# Altium schematic sheet BMS_peripherial.SchDoc
size 420 x 297 mm; SheetNumber: 2; SheetTotal: 5
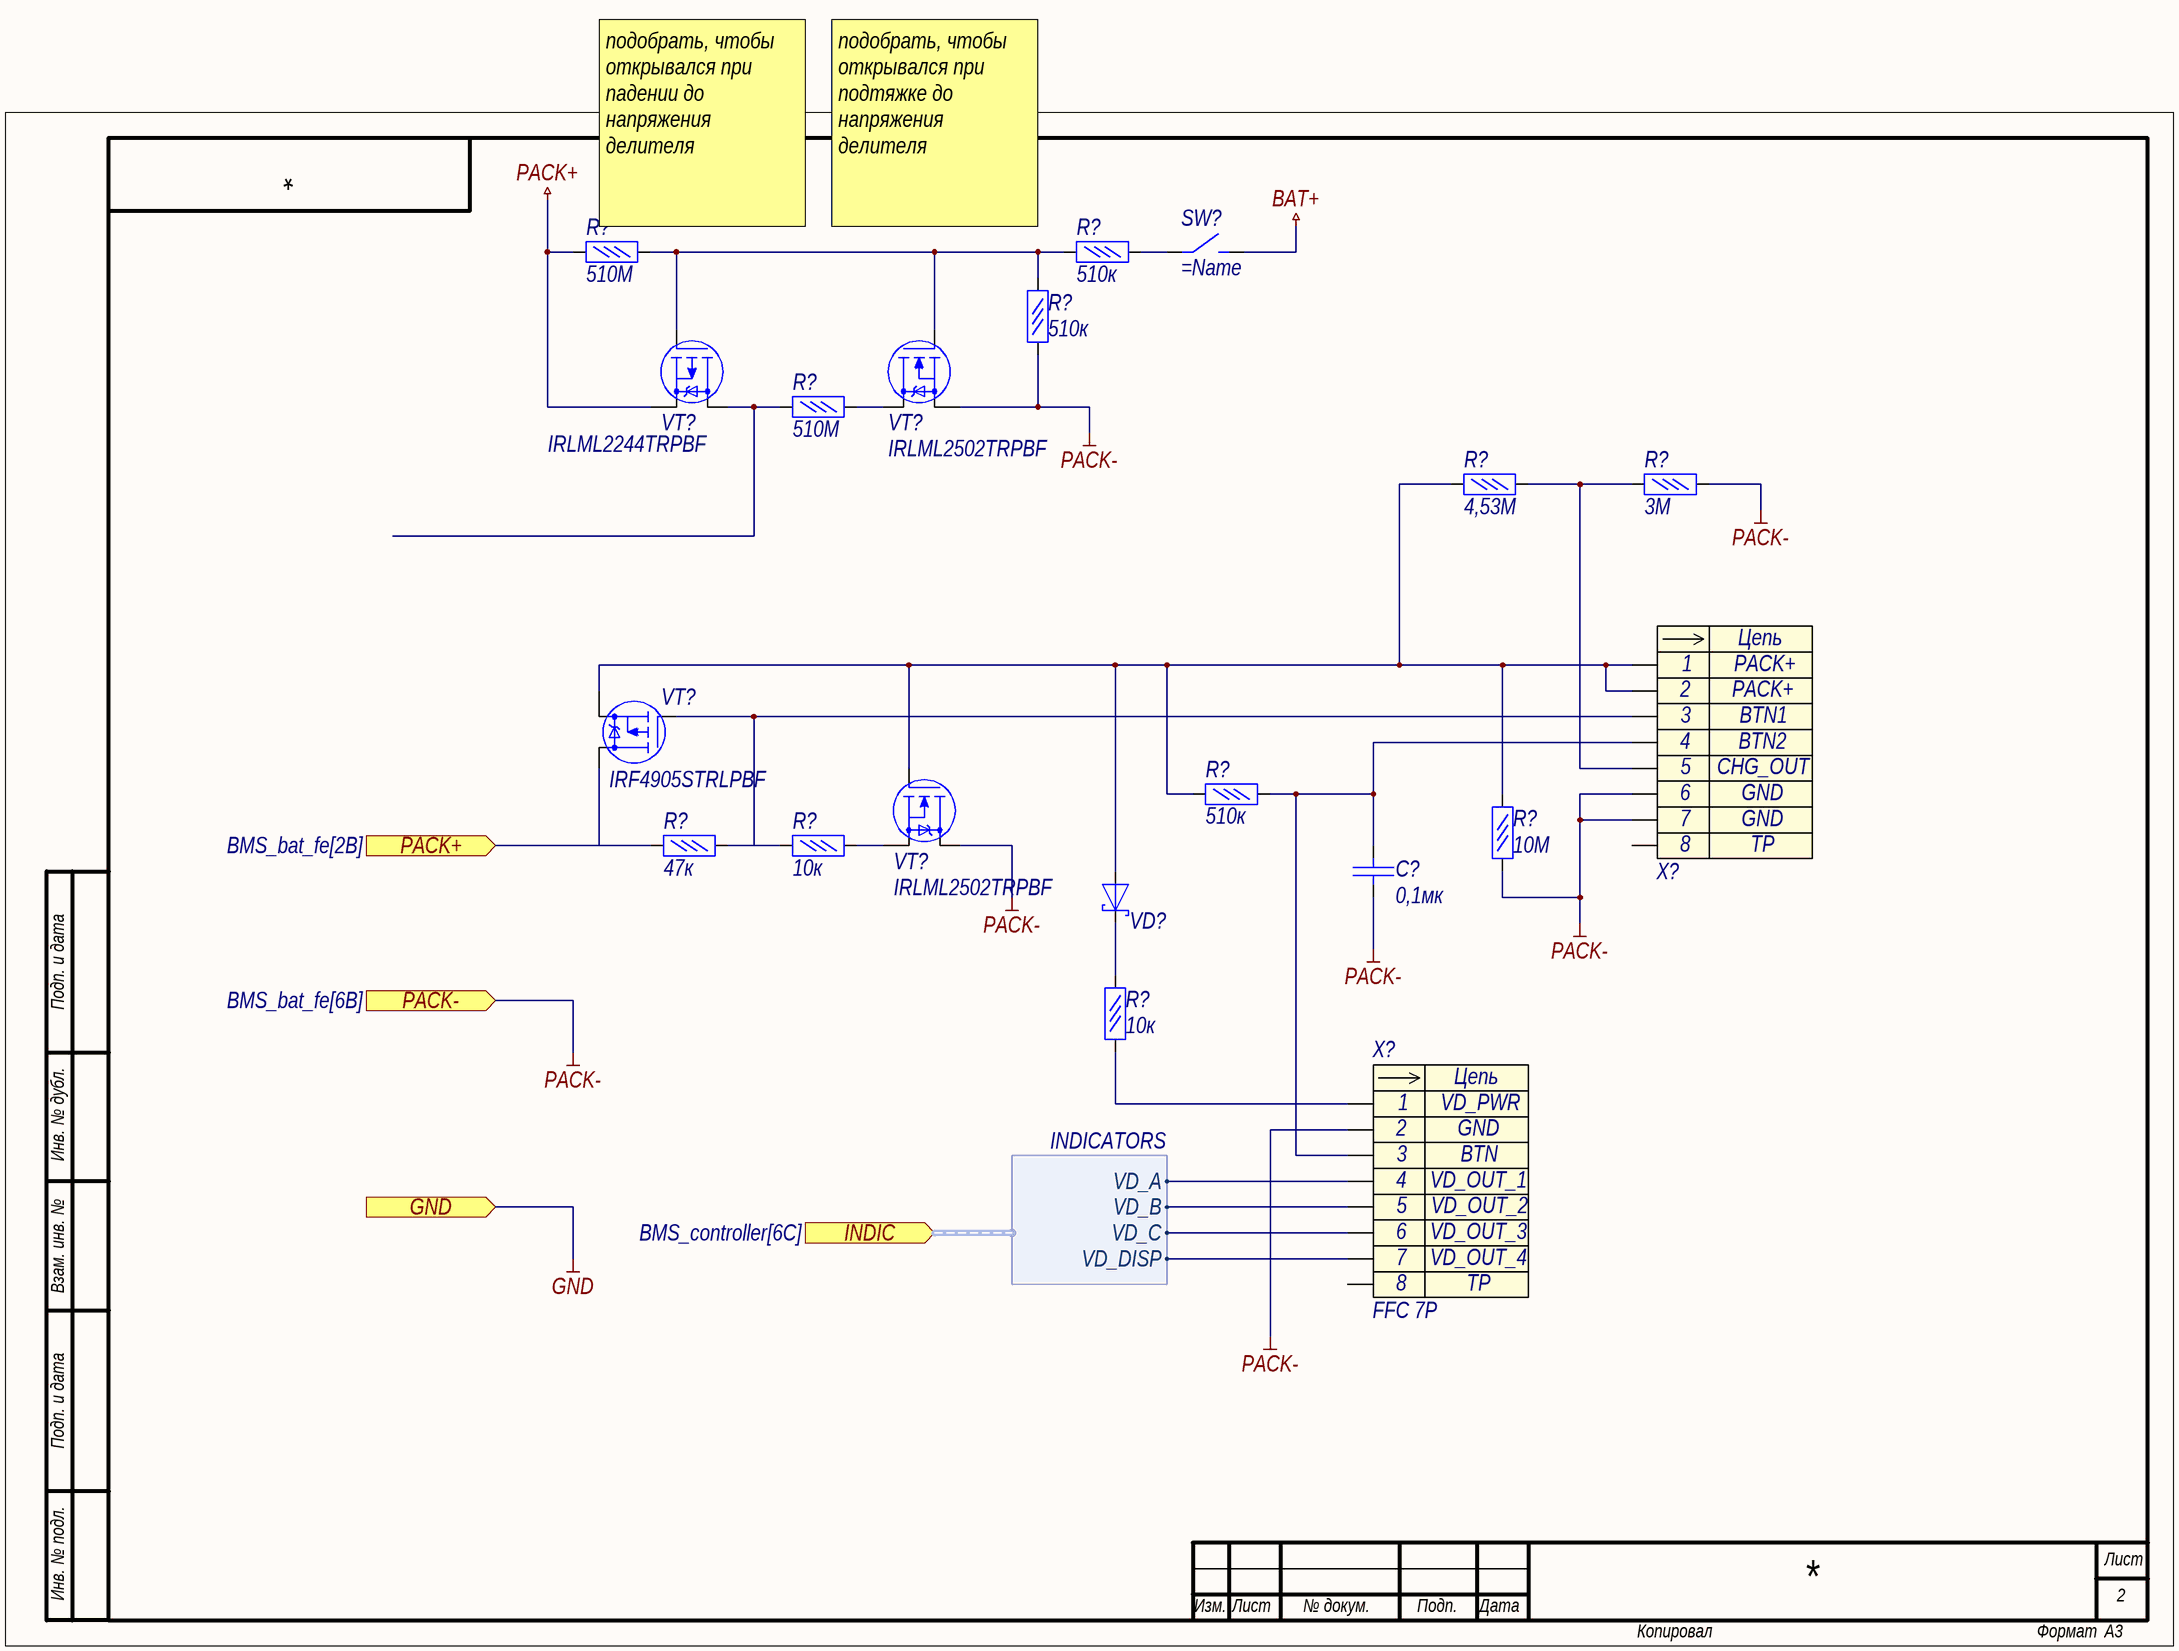
[diagram p0: BMS_peripherial.SchDoc]

## Parts
(Parts that share a designator on the sheet are numbered #1, #2 ... from top to bottom, then left to right.)
R?#1  510М  [R0603]
R?#2  510к  [R0603]
R?#3  510к  [R0603]
R?#4  510М  [R0603]
R?#5  4,53М  [R0603]
R?#6  3М  [R0603]
R?#7  10к  [R0603]
R?#8  510к  [R0603]
R?#9  47к  [R0603]
R?#10  10М  [R0603]
R?#11  10к  [R0603]
SW?  (no value)  [it-1187]
VD?  1N5817WS  [SOD323]  (value not drawn)
VT?#1  IRLML2244TRPBF  [SOT23]
VT?#2  IRLML2502TRPBF  [SOT23]
VT?#3  IRF4905STRLPBF  [D2PAK]
VT?#4  IRLML2502TRPBF  [SOT23]
X?#1  (no value)  [2+5P Header]
X?#2  FFC 7P  [LCP UL94-V0]
С?  0,1мк  [C0603]

## Ports
GND (in), INDIC (in, harness INDICATORS, see BMS_controller[6C]), PACK+ (in, see BMS_bat_fe[2B]), PACK- (in, see BMS_bat_fe[6B])

## Harnesses
INDICATORS: VD_A, VD_B, VD_C, VD_DISP

## Nets
BAT+: SW?.2
GND: port GND
PACK+: R?#1.2 VT?#1.2(S)
PACK-: R?#3.1 R?#6.1 R?#10.1 VT?#2.2(S) VT?#4.3(D) X?#1.6 X?#1.7 X?#2.2 С?.2 ; port PACK-
PACK+: R?#9.1 VT?#3.3(D) ; port PACK+  [a separate net that carries the same name]
NetR?#1_1: R?#1.1 R?#2.1 R?#3.2 VT?#1.1(G) VT?#2.1(G)
NetR?#2_2: R?#2.2 SW?.1
NetR?#4_1: R?#4.1 VT?#2.3(D)
NetR?#4_2: R?#4.2 VT?#1.3(D)
NetR?#5_1: R?#5.1 R?#6.2 X?#1.5
NetR?#5_2: R?#5.2 R?#8.1 R?#10.2 VD?.2(A) VT?#3.2(S) VT?#4.1(G) X?#1.1 X?#1.2
NetR?#7_1: R?#7.1 VT?#4.2(S)
NetR?#7_2: R?#7.2 R?#9.2 VT?#3.1(G) X?#1.3
NetR?#8_2: R?#8.2 X?#1.4 X?#2.3 С?.1
NetR?#11_1: R?#11.1 X?#2.1
NetR?#11_2: R?#11.2 VD?.1(K)
NetX?#2_4: X?#2.4 ; port INDIC.VD_A
NetX?#2_5: X?#2.5 ; port INDIC.VD_B
NetX?#2_6: X?#2.6 ; port INDIC.VD_C
NetX?#2_7: X?#2.7 ; port INDIC.VD_DISP

Not connected (* = marked no-connect by the designer): X?#1 0; X?#2 0

## Notes on the sheet
- (near R?#1) подобрать, чтобы открывался при падении до напряжения делителя
- (near R?#2) подобрать, чтобы открывался при подтяжке до напряжения делителя
- Подп. и дата
- Инв. № дубл.
- Взам. инв. №
- Инв. № подл.
- Лист
- Изм.
- № докум.
- Подп.
- Дата
- Копировал
- Формат
- А3
- (in symbol Header_7) Цепь; 8

## Library data of the parts
R?#1-R?#11 = Резистор 0.05Вт: Резистор 0,05Вт
  R?#1 R?#4: Value: 510М
  R?#2 R?#3 R?#8: Value: 510к
  R?#5: Value: 4,53М
  R?#6: Value: 3М
  R?#7 R?#11: Value: 10к
  R?#9: Value: 47к
  R?#10: Value: 10М
SW? = button
VD? = Diode Shottky: Диод Шоттки; Name: 1N5817WS
VT?#1 = IRLML2244TRPBF: мосфет p-канал IRLML2244TRPBF; Name: IRLML2244TRPBF
VT?#2 VT?#4 = IRLML2502TRPBF: мосфет n-канал IRLML2502TRPBF; Name: IRLML2502TRPBF
VT?#3 = IRFR5305TRPBF: Транзистор полевой P-канальный -55В -31А 110Вт 0,065Ом; Name: IRF4905STRLPBF
X?#1 = Header_7: Разъем - 7 конт. мама; Contact_1: PACK+; Contact_3: BTN1; Contact_4: BTN2; Contact_5: CHG_OUT; Contact_6: GND; Contact_8: TP; Contact_2: PACK+; Contact_7: GND
X?#2 = Header_7: Разъем - 7 конт. мама; Contact_1: VD_PWR; Contact_2: GND; Contact_3: BTN; Contact_4: VD_OUT_1; Contact_5: VD_OUT_2; Contact_6: VD_OUT_3; Contact_7: VD_OUT_4; Contact_8: TP; Name: FFC 7P
С? = Кер. конденсатор: Value: 0,1мк